# Altium project Instigator2012.PrjPcb
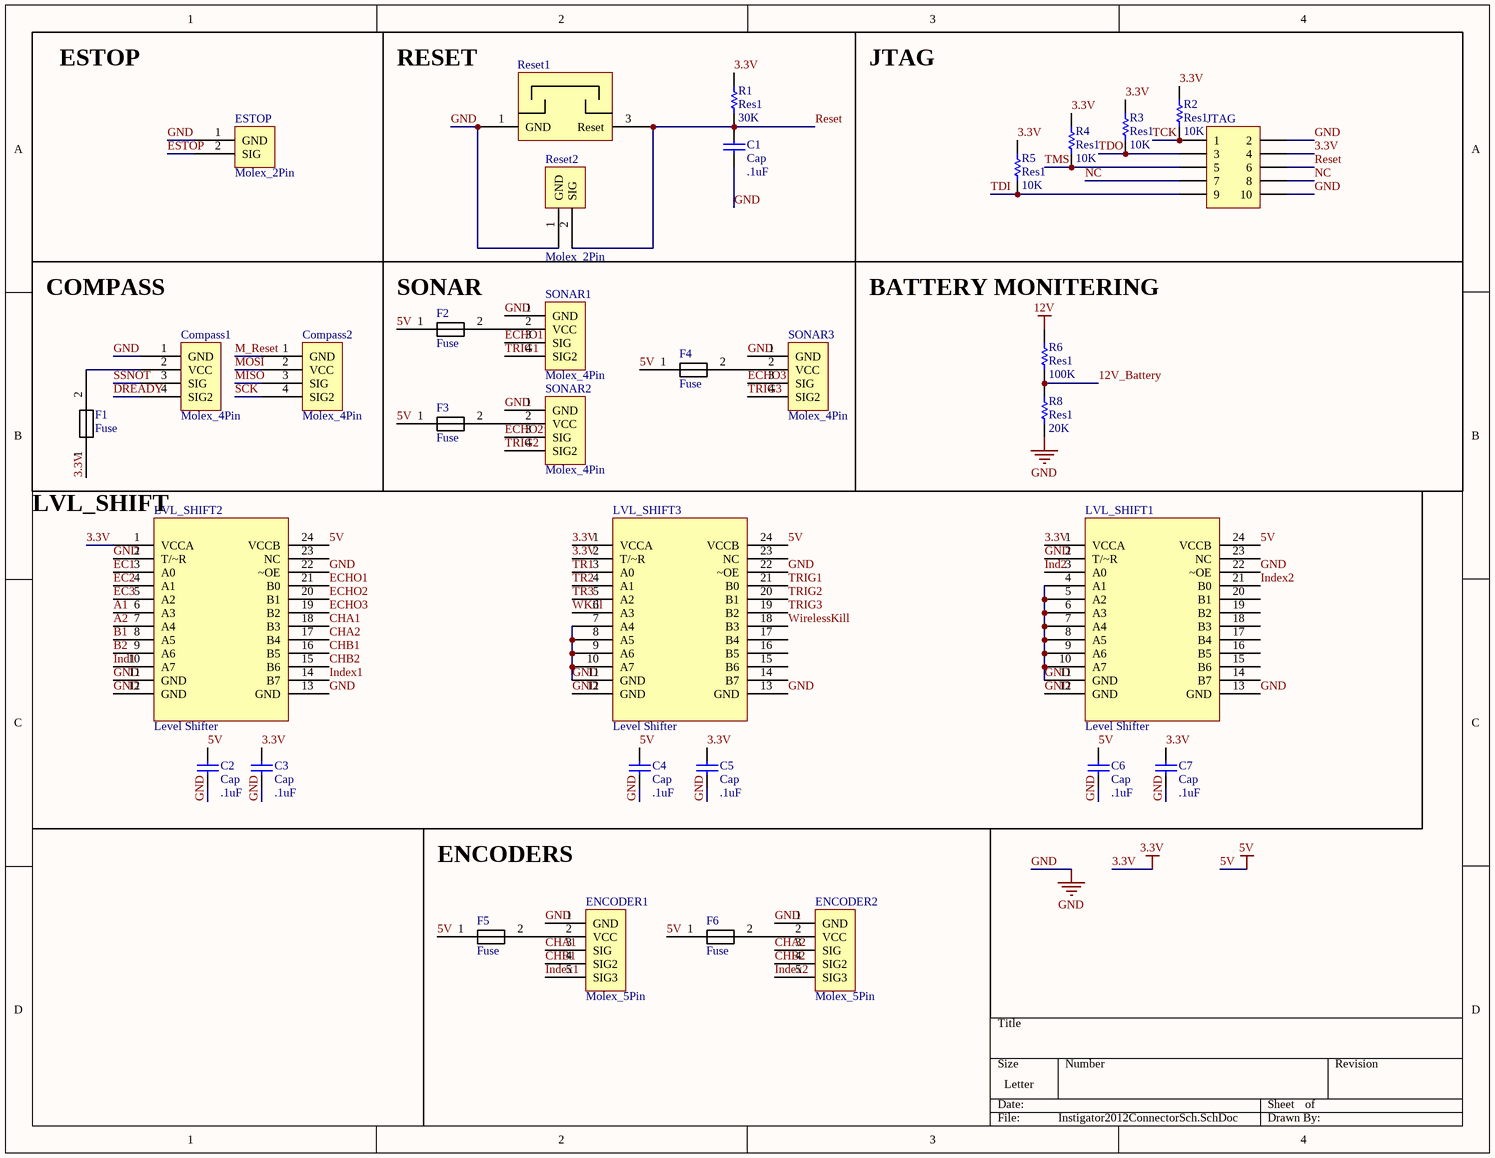
[diagram p0: Instigator2012ConnectorSch.SchDoc]
4 sheets, 101 parts. Net scope: global (net labels, ports and power ports of the same name join across sheets).
Board file: Instigator2012.PcbDoc
Sheets:
  Instigator2012ConnectorSch.SchDoc
  Instigator2012ControllerBoard.SchDoc
  Power_SolenoidKill.SchDoc
  USB_FTDI.SchDoc

## Sheet Instigator2012ConnectorSch.SchDoc
size Letter; DocumentNumber: 2; SheetNumber: 2; SheetTotal: 4

### Parts
C1  Cap  value .1uF  [1608[0603]]
C2  Cap  value .1uF  [1608[0603]]
C3  Cap  value .1uF  [1608[0603]]
C4  Cap  value .1uF  [1608[0603]]
C5  Cap  value .1uF  [1608[0603]]
C6  Cap  value .1uF  [1608[0603]]
C7  Cap  value .1uF  [1608[0603]]
Compass1  Molex_4Pin  [PCBComponent_1]
Compass2  Molex_4Pin  [PCBComponent_1]
ENCODER1  Molex_5Pin  [PCBComponent_1]
ENCODER2  Molex_5Pin  [PCBComponent_1]
ESTOP  Molex_2Pin  [PCBComponent_1]
F1  Fuse  [PCBComponent_1 - duplicate]
F2  Fuse  [PCBComponent_1 - duplicate]
F3  Fuse  [PCBComponent_1 - duplicate]
F4  Fuse  [PCBComponent_1 - duplicate]
F5  Fuse  [PCBComponent_1 - duplicate]
F6  Fuse  [PCBComponent_1 - duplicate]
JTAG  Header 5X2  [HDR2X5]  (value not drawn)
LVL_SHIFT1  Level Shifter  [TSOP65P640X110-24N]
LVL_SHIFT2  Level Shifter  [TSOP65P640X110-24N]
LVL_SHIFT3  Level Shifter  [TSOP65P640X110-24N]
R1  Res1  value 30K  [1608[0603]]
R2  Res1  value 10K  [1608[0603]]
R3  Res1  value 10K  [1608[0603]]
R4  Res1  value 10K  [1608[0603]]
R5  Res1  value 10K  [1608[0603]]
R6  Res1  value 100K  [1608[0603]]
R8  Res1  value 20K  [1608[0603]]
Reset1  l  [PCBComponent_1]  (value not drawn)
Reset2  Molex_2Pin  [PCBComponent_1]
SONAR1  Molex_4Pin  [PCBComponent_1]
SONAR2  Molex_4Pin  [PCBComponent_1]
SONAR3  Molex_4Pin  [PCBComponent_1]

### Blocks framed on the sheet
JTAG: JTAG R2-R5

### Nets
3.3V: C3.2 C5.2 C7.2 F1.1 JTAG.4 LVL_SHIFT1.1(VCCA) LVL_SHIFT2.1(VCCA) LVL_SHIFT3.1(VCCA) LVL_SHIFT3.2(T/~R) R1.2 R2.2 R3.2 R4.2 R5.2
5V: C2.2 C4.2 C6.2 F2.1 F3.1 F4.1 F5.1 F6.1 LVL_SHIFT1.24(VCCB) LVL_SHIFT2.24(VCCB) LVL_SHIFT3.24(VCCB)
12V: R6.2
GND: C1.1 C2.1 C3.1 C4.1 C5.1 C6.1 C7.1 Compass1.1(GND) ENCODER1.1(GND) ENCODER2.1(GND) ESTOP.1(GND) JTAG.2 JTAG.10 LVL_SHIFT1.2(T/~R) LVL_SHIFT1.4(A1) LVL_SHIFT1.5(A2) LVL_SHIFT1.6(A3) LVL_SHIFT1.7(A4) LVL_SHIFT1.8(A5) LVL_SHIFT1.9(A6) LVL_SHIFT1.10(A7) LVL_SHIFT1.11(GND) LVL_SHIFT1.12(GND) LVL_SHIFT1.13(GND) LVL_SHIFT1.22(~OE) LVL_SHIFT2.2(T/~R) LVL_SHIFT2.11(GND) LVL_SHIFT2.12(GND) LVL_SHIFT2.13(GND) LVL_SHIFT2.22(~OE) LVL_SHIFT3.7(A4) LVL_SHIFT3.8(A5) LVL_SHIFT3.9(A6) LVL_SHIFT3.10(A7) LVL_SHIFT3.11(GND) LVL_SHIFT3.12(GND) LVL_SHIFT3.13(GND) LVL_SHIFT3.22(~OE) R8.1 Reset1.1(GND) Reset2.1(GND) SONAR1.1(GND) SONAR2.1(GND) SONAR3.1(GND)
12V_Battery: R6.1 R8.2
A1: LVL_SHIFT2.6(A3)
A2: LVL_SHIFT2.7(A4)
B1: LVL_SHIFT2.8(A5)
B2: LVL_SHIFT2.9(A6)
CHA1: ENCODER1.3(SIG) LVL_SHIFT2.18(B3)
CHA2: ENCODER2.3(SIG) LVL_SHIFT2.17(B4)
CHB1: ENCODER1.4(SIG2) LVL_SHIFT2.16(B5)
CHB2: ENCODER2.4(SIG2) LVL_SHIFT2.15(B6)
DREADY: Compass1.4(SIG2)
EC1: LVL_SHIFT2.3(A0)
EC2: LVL_SHIFT2.4(A1)
EC3: LVL_SHIFT2.5(A2)
ECHO1: LVL_SHIFT2.21(B0) SONAR1.3(SIG)
ECHO2: LVL_SHIFT2.20(B1) SONAR2.3(SIG)
ECHO3: LVL_SHIFT2.19(B2) SONAR3.3(SIG)
ESTOP: ESTOP.2(SIG)
Ind1: LVL_SHIFT2.10(A7)
Ind2: LVL_SHIFT1.3(A0)
Index1: ENCODER1.5(SIG3) LVL_SHIFT2.14(B7)
Index2: ENCODER2.5(SIG3) LVL_SHIFT1.21(B0)
M_Reset: Compass2.1(GND)
MISO: Compass2.3(SIG)
MOSI: Compass2.2(VCC)
NC: JTAG.7 JTAG.8
Reset: C1.2 JTAG.6 R1.1 Reset1.3(Reset) Reset2.2(SIG)
SCK: Compass2.4(SIG2)
SSNOT: Compass1.3(SIG)
TCK: JTAG.1 R2.1
TDI: JTAG.9 R5.1
TDO: JTAG.3 R3.1
TMS: JTAG.5 R4.1
TR1: LVL_SHIFT3.3(A0)
TR2: LVL_SHIFT3.4(A1)
TR3: LVL_SHIFT3.5(A2)
TRIG1: LVL_SHIFT3.21(B0) SONAR1.4(SIG2)
TRIG2: LVL_SHIFT3.20(B1) SONAR2.4(SIG2)
TRIG3: LVL_SHIFT3.19(B2) SONAR3.4(SIG2)
WirelessKill: LVL_SHIFT3.18(B3)
WKill: LVL_SHIFT3.6(A3)
NetCompass1_2: Compass1.2(VCC) F1.2
NetENCODER1_2: ENCODER1.2(VCC) F5.2
NetENCODER2_2: ENCODER2.2(VCC) F6.2
NetF2_2: F2.2 SONAR1.2(VCC)
NetF3_2: F3.2 SONAR2.2(VCC)
NetF4_2: F4.2 SONAR3.2(VCC)

Not connected (* = marked no-connect by the designer): LVL_SHIFT1 14(B7) 15(B6) 16(B5) 17(B4) 18(B3) 19(B2) 20(B1) 23(NC); LVL_SHIFT2 23(NC); LVL_SHIFT3 14(B7) 15(B6) 16(B5) 17(B4) 23(NC)

### Notes on the sheet
- ESTOP
- RESET
- COMPASS
- (near F2) SONAR
- (near R6) BATTERY MONITERING
- (near LVL_SHIFT2) LVL_SHIFT
- ENCODERS

### Library data of the parts
C1-C7 = Cap: Capacitor; Published: 8-Jun-2000; LatestRevisionDate: 17-Jul-2002; LatestRevisionNote: Re-released for DXP Platform.; PackageReference: RAD-0.3; Publisher: Altium Limited; PackageDescription: Radial Cap, Thru-Hole; 2 Leads; 0.3 in Pin Spacing
JTAG = Header 5X2: Header, 5-Pin, Dual row; LatestRevisionDate: 17-Jul-2002; LatestRevisionNote: Re-released for DXP Platform.; Publisher: Altium Limited
R1-R6 R8 = Res1: Resistor; Published: 8-Jun-2000; LatestRevisionDate: 17-Jul-2002; LatestRevisionNote: Re-released for DXP Platform.; PackageReference: AXIAL-0.3; Publisher: Altium Limited; PackageDescription: Axial Device, Thru-Hole; 2 Leads; 0.3 in Pin Spacing
Reset1 = Component_1

## Sheet Instigator2012ControllerBoard.SchDoc
size Letter; DocumentNumber: 1; SheetNumber: 1; SheetTotal: 4
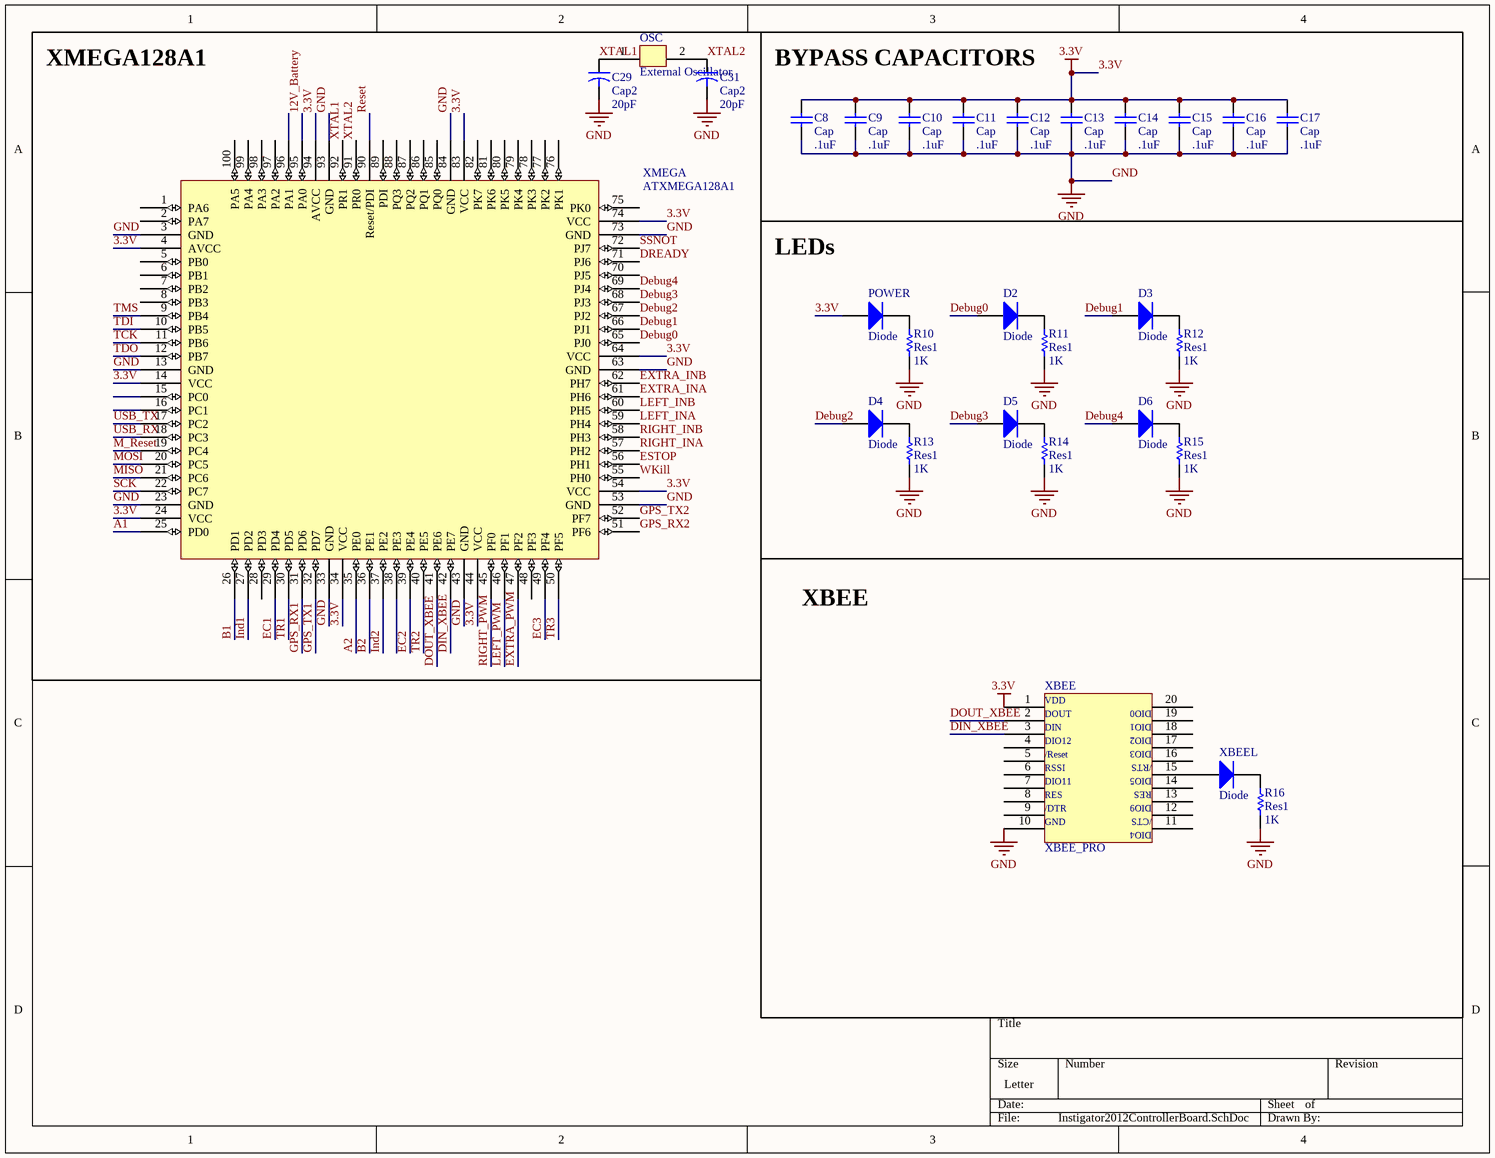
[diagram p1: Instigator2012ControllerBoard.SchDoc]

### Parts
C8  Cap  value .1uF  [1608[0603]]
C9  Cap  value .1uF  [1608[0603]]
C10  Cap  value .1uF  [1608[0603]]
C11  Cap  value .1uF  [1608[0603]]
C12  Cap  value .1uF  [1608[0603]]
C13  Cap  value .1uF  [1608[0603]]
C14  Cap  value .1uF  [1608[0603]]
C15  Cap  value .1uF  [1608[0603]]
C16  Cap  value .1uF  [1608[0603]]
C17  Cap  value .1uF  [1608[0603]]
C29  Cap2  value 20pF  [1608[0603]]
C31  Cap2  value 20pF  [1608[0603]]
D2  Diode  [1608[0603]]
D3  Diode  [1608[0603]]
D4  Diode  [1608[0603]]
D5  Diode  [1608[0603]]
D6  Diode  [1608[0603]]
OSC  External Oscillator  [PCBComponent_1 - duplicate3]
POWER  Diode  [1608[0603]]
R10  Res1  value 1K  [1608[0603]]
R11  Res1  value 1K  [1608[0603]]
R12  Res1  value 1K  [1608[0603]]
R13  Res1  value 1K  [1608[0603]]
R14  Res1  value 1K  [1608[0603]]
R15  Res1  value 1K  [1608[0603]]
R16  Res1  value 1K  [1608[0603]]
XBEE  XBEE_PRO  [PCBComponent_1]
XBEEL  Diode  [1608[0603]]
XMEGA  ATXMEGA128A1  [TSQFP50P1600X1600X120-100N]

### Blocks framed on the sheet
XMEGA128A1: C29 C31 OSC XMEGA

### Nets
3.3V: C8.2 C9.2 C10.2 C11.2 C12.2 C13.2 C14.2 C15.2 C16.2 C17.2 POWER.1(A) XBEE.1 XMEGA.4(AVCC) XMEGA.14(VCC) XMEGA.24(VCC) XMEGA.34(VCC) XMEGA.44(VCC) XMEGA.54(VCC) XMEGA.64(VCC) XMEGA.74(VCC) XMEGA.83(VCC) XMEGA.94(AVCC)
GND: C8.1 C9.1 C10.1 C11.1 C12.1 C13.1 C14.1 C15.1 C16.1 C17.1 C29.2 C31.2 R10.1 R11.1 R12.1 R13.1 R14.1 R15.1 R16.1 XBEE.10 XMEGA.3(GND) XMEGA.13(GND) XMEGA.23(GND) XMEGA.33(GND) XMEGA.43(GND) XMEGA.53(GND) XMEGA.63(GND) XMEGA.73(GND) XMEGA.84(GND) XMEGA.93(GND)
12V_Battery: XMEGA.95(PA0)
A1: XMEGA.25(PD0)
A2: XMEGA.35(PE0)
B1: XMEGA.26(PD1)
B2: XMEGA.36(PE1)
Debug0: D2.1(A) XMEGA.65(PJ0)
Debug1: D3.1(A) XMEGA.66(PJ1)
Debug2: D4.1(A) XMEGA.67(PJ2)
Debug3: D5.1(A) XMEGA.68(PJ3)
Debug4: D6.1(A) XMEGA.69(PJ4)
DIN_XBEE: XBEE.3 XMEGA.42(PE7)
DOUT_XBEE: XBEE.2 XMEGA.41(PE6)
DREADY: XMEGA.71(PJ6)
EC1: XMEGA.29(PD4)
EC2: XMEGA.39(PE4)
EC3: XMEGA.49(PF4)
ESTOP: XMEGA.56(PH1)
EXTRA_INA: XMEGA.61(PH6)
EXTRA_INB: XMEGA.62(PH7)
EXTRA_PWM: XMEGA.47(PF2)
GPS_RX1: XMEGA.31(PD6)
GPS_RX2: XMEGA.51(PF6)
GPS_TX1: XMEGA.32(PD7)
GPS_TX2: XMEGA.52(PF7)
Ind1: XMEGA.27(PD2)
Ind2: XMEGA.37(PE2)
LEFT_INA: XMEGA.59(PH4)
LEFT_INB: XMEGA.60(PH5)
LEFT_PWM: XMEGA.46(PF1)
M_Reset: XMEGA.19(PC4)
MISO: XMEGA.21(PC6)
MOSI: XMEGA.20(PC5)
Reset: XMEGA.90(Reset/PDI)
RIGHT_INA: XMEGA.57(PH2)
RIGHT_INB: XMEGA.58(PH3)
RIGHT_PWM: XMEGA.45(PF0)
SCK: XMEGA.22(PC7)
SSNOT: XMEGA.72(PJ7)
TCK: XMEGA.11(PB6)
TDI: XMEGA.10(PB5)
TDO: XMEGA.12(PB7)
TMS: XMEGA.9(PB4)
TR1: XMEGA.30(PD5)
TR2: XMEGA.40(PE5)
TR3: XMEGA.50(PF5)
USB_RX: XMEGA.18(PC3)
USB_TX: XMEGA.17(PC2)
WKill: XMEGA.55(PH0)
XTAL1: C29.1 OSC.1 XMEGA.92(PR1)
XTAL2: C31.1 OSC.2 XMEGA.91(PR0)
NetD2_2: D2.2(K) R11.2
NetD3_2: D3.2(K) R12.2
NetD4_2: D4.2(K) R13.2
NetD5_2: D5.2(K) R14.2
NetD6_2: D6.2(K) R15.2
NetPOWER_2: POWER.2(K) R10.2
NetR16_2: R16.2 XBEEL.2(K)
NetXBEE_15: XBEE.15 XBEEL.1(A)

Not connected (* = marked no-connect by the designer): XBEE 4 5 6 7 8 9 11 12 13 14 16 17 18 19 20; XMEGA 1(PA6) 2(PA7) 5(PB0) 6(PB1) 7(PB2) 8(PB3) 15(PC0) 16(PC1) 28(PD3) 38(PE3) 48(PF3) 70(PJ5) 75(PK0) 76(PK1) 77(PK2) 78(PK3) 79(PK4) 80(PK5) 81(PK6) 82(PK7) 85(PQ0) 86(PQ1) 87(PQ2) 88(PQ3) 89(PDI) 96(PA1) 97(PA2) 98(PA3) 99(PA4) 100(PA5)

### Notes on the sheet
- BYPASS CAPACITORS
- LEDs
- XBEE
- (in symbol XBEE) VDD; DIO0; DOUT; DIO1; DIN; DIO2; DIO12; DIO3; /Reset; /RTS; RSSI; DIO5; DIO11; RES; DIO9; /DTR; /CTS; GND; DIO4

### Library data of the parts
C8-C17 = Cap: Capacitor; Published: 8-Jun-2000; LatestRevisionDate: 17-Jul-2002; LatestRevisionNote: Re-released for DXP Platform.; PackageReference: RAD-0.3; Publisher: Altium Limited; PackageDescription: Radial Cap, Thru-Hole; 2 Leads; 0.3 in Pin Spacing
C29 C31 = Cap2: Capacitor; Published: 23-Sep-2002; PackageReference: CAPR5-4X5; Publisher: Altium Limited; PackageDescription: Capacitor; 2 Leads
D2-D6 POWER XBEEL = Diode: Default Diode; Published: 8-Jun-2000; LatestRevisionDate: 17-Jul-2002; LatestRevisionNote: Re-released for DXP Platform.; PackageVersion: Sep-1996; PackageReference: SMC; Publisher: Altium Limited; PackageDescription: DO-214-AB/SMC; 2 C-Bend Leads; Body 7.9 x 5.9 mm, inc. leads (LxW); Code_JEDEC: DO-214-AB
R10-R16 = Res1: Resistor; Published: 8-Jun-2000; LatestRevisionDate: 17-Jul-2002; LatestRevisionNote: Re-released for DXP Platform.; PackageReference: AXIAL-0.3; Publisher: Altium Limited; PackageDescription: Axial Device, Thru-Hole; 2 Leads; 0.3 in Pin Spacing
XBEE = XBEE

## Sheet Power_SolenoidKill.SchDoc
size Letter; DocumentNumber: 4; SheetNumber: 4; SheetTotal: 4
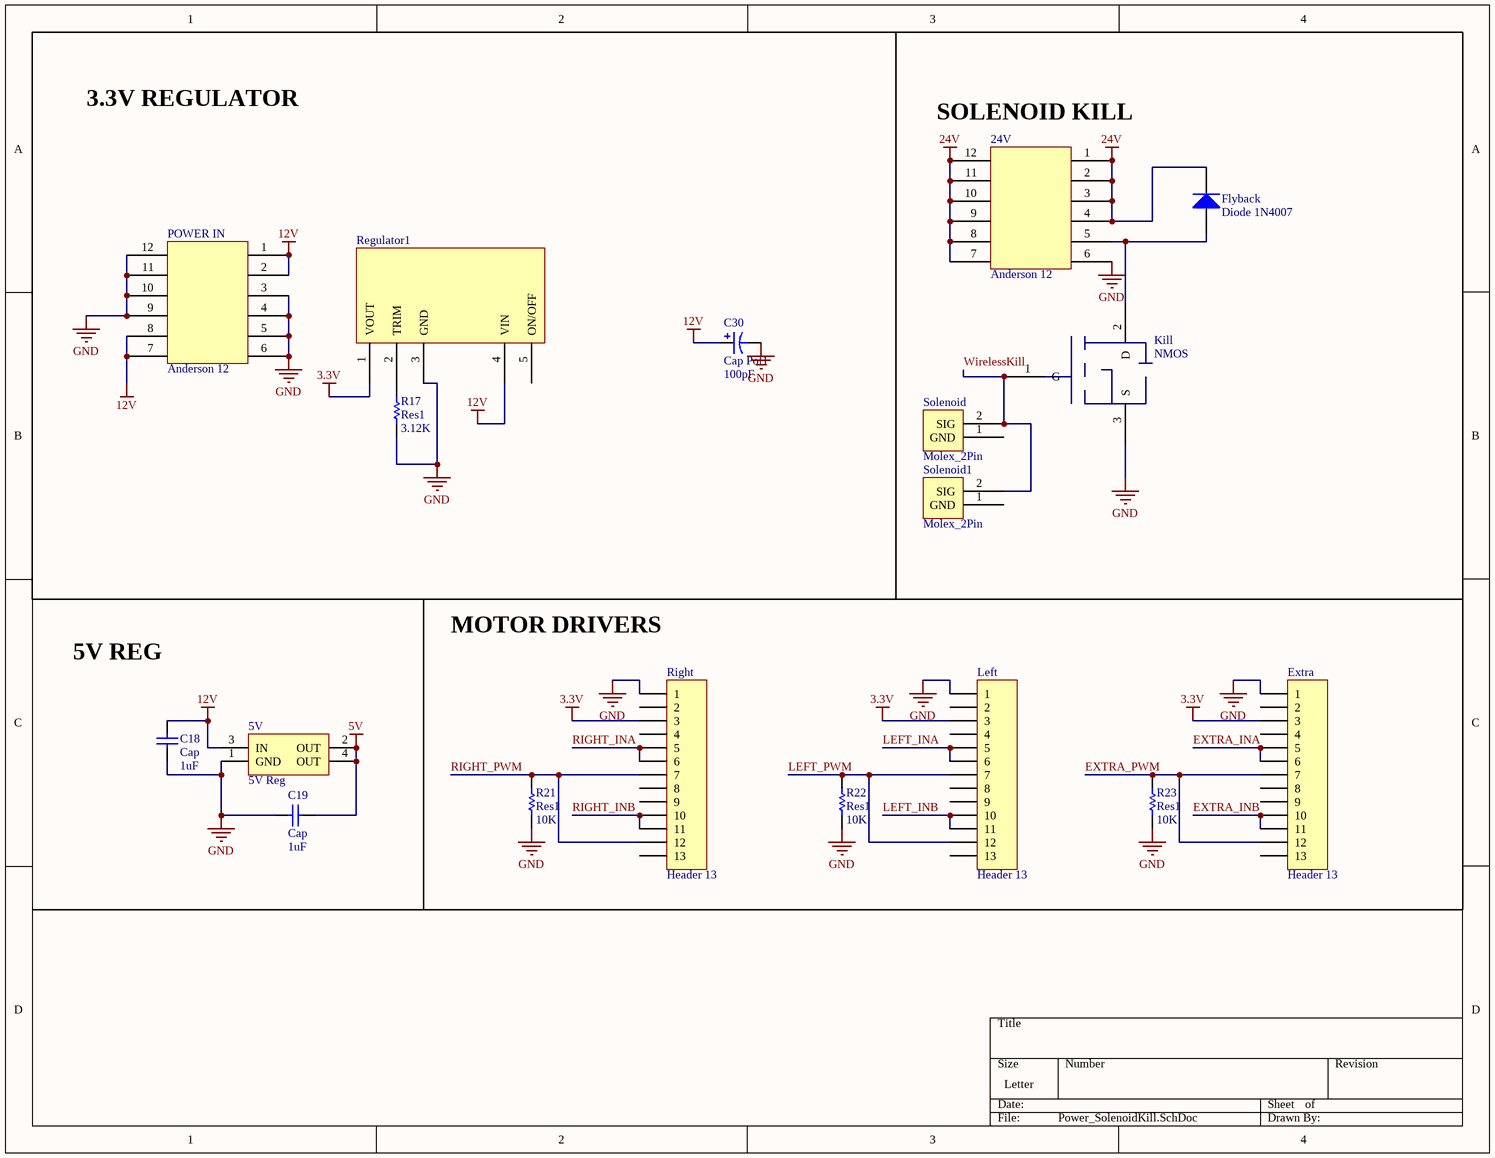
[diagram p2: Power_SolenoidKill.SchDoc]

### Parts
5V  5V Reg  [5V REG]
24V  Anderson 12  [PCBComponent_1 - duplicate2]
C18  Cap  value 1uF  [1608[0603]]
C19  Cap  value 1uF  [1608[0603]]
C30  Cap Pol1  value 100pF  [RB5-10.5]
Extra  Header 13  [HDR1X13]
Flyback  Diode 1N4007  [DO-41]
Kill  NMOS  [TO229P990X239-3N]
Left  Header 13  [HDR1X13]
POWER_IN  Anderson 12  [PCBComponent_1 - duplicate2]
R17  Res1  value 3.12K  [1608[0603]]
R21  Res1  value 10K  [1608[0603]]
R22  Res1  value 10K  [1608[0603]]
R23  Res1  value 10K  [1608[0603]]
Regulator1  Regulator  [PCBComponent_1]  (value not drawn)
Right  Header 13  [HDR1X13]
Solenoid  Molex_2Pin  [PCBComponent_1]
Solenoid1  Molex_2Pin  [PCBComponent_1]

### Blocks framed on the sheet
SOLENOID KILL: 24V Flyback Kill Solenoid Solenoid1

### Nets
3.3V: Extra.3 Left.3 Regulator1.1(VOUT) Right.3
5V: 5V.2(OUT) 5V.4(OUT) C19.1
12V: 5V.3(IN) C18.1 C30.1 POWER_IN.1 POWER_IN.2 POWER_IN.7 POWER_IN.8 Regulator1.4(VIN)
24V: 24V.1 24V.2 24V.3 24V.4 24V.7 24V.8 24V.9 24V.10 24V.11 24V.12 Flyback.2(K)
GND: 5V.1(GND) 24V.6 C18.2 C19.2 C30.2 Extra.1 Kill.3(S) Left.1 POWER_IN.3 POWER_IN.4 POWER_IN.5 POWER_IN.6 POWER_IN.9 POWER_IN.10 POWER_IN.11 POWER_IN.12 R17.1 R21.1 R22.1 R23.1 Regulator1.3(GND) Right.1
EXTRA_INA: Extra.5 Extra.6
EXTRA_INB: Extra.10 Extra.11
EXTRA_PWM: Extra.7 Extra.12 R23.2
LEFT_INA: Left.5 Left.6
LEFT_INB: Left.10 Left.11
LEFT_PWM: Left.7 Left.12 R22.2
RIGHT_INA: Right.5 Right.6
RIGHT_INB: Right.10 Right.11
RIGHT_PWM: R21.2 Right.7 Right.12
WirelessKill: Kill.1(G) Solenoid.2(SIG) Solenoid1.2(SIG)
Net24V_5: 24V.5 Flyback.1(A) Kill.2(D)
NetR17_2: R17.2 Regulator1.2(TRIM)

Not connected (* = marked no-connect by the designer): Extra 2 4 8 9 13; Left 2 4 8 9 13; Regulator1 5(ON/OFF); Right 2 4 8 9 13; Solenoid 1(GND); Solenoid1 1(GND)

### Notes on the sheet
- 3.3V REGULATOR
- MOTOR DRIVERS
- 5V REG

### Library data of the parts
5V = 5V Reg: 5V Linear Reg, 1.5A (Digi-Key: ADP3339AKCZ-5-R7CT-ND)
C18 C19 = Cap: Capacitor; Published: 8-Jun-2000; LatestRevisionDate: 17-Jul-2002; LatestRevisionNote: Re-released for DXP Platform.; PackageReference: RAD-0.3; Publisher: Altium Limited; PackageDescription: Radial Cap, Thru-Hole; 2 Leads; 0.3 in Pin Spacing
C30 = Cap Pol1: Polarized Capacitor (Radial); Published: 8-Jun-2000; LatestRevisionDate: 17-Jul-2002; LatestRevisionNote: Re-released for DXP Platform.; PackageReference: RB7.6-15; Publisher: Altium Limited; PackageDescription: Polarized Capacitor (Radial); 2 Leads
Extra Left Right = Header 13: Header, 13-Pin; LatestRevisionDate: 17-Jul-2002; LatestRevisionNote: Re-released for DXP Platform.; Publisher: Altium Limited
Flyback = Diode 1N4007: 1 Amp General Purpose Rectifier; Published: 8-Jun-2000; LatestRevisionDate: 17-Jul-2002; LatestRevisionNote: Re-released for DXP Platform.; DatasheetVersion: 1998; PackageVersion: Aug-1999; PackageReference: DO-41; Publisher: Altium Limited; PackageDescription: Diode, Axial; Body 5.2 x 2.7 mm (LxDia. max), Lead Dia. 0.86 mm (max); Code_JEDEC: DO-204-AL; ComponentLink1Description: Manufacturer Link; ComponentLink1URL: http://www.fairchildsemi.com/; ComponentLink2Description: Datasheet; ComponentLink2URL: http://www.fairchildsemi.com/ds/1N%2F1N4001.pdf
R17 R21-R23 = Res1: Resistor; Published: 8-Jun-2000; LatestRevisionDate: 17-Jul-2002; LatestRevisionNote: Re-released for DXP Platform.; PackageReference: AXIAL-0.3; Publisher: Altium Limited; PackageDescription: Axial Device, Thru-Hole; 2 Leads; 0.3 in Pin Spacing

## Sheet USB_FTDI.SchDoc
size Letter
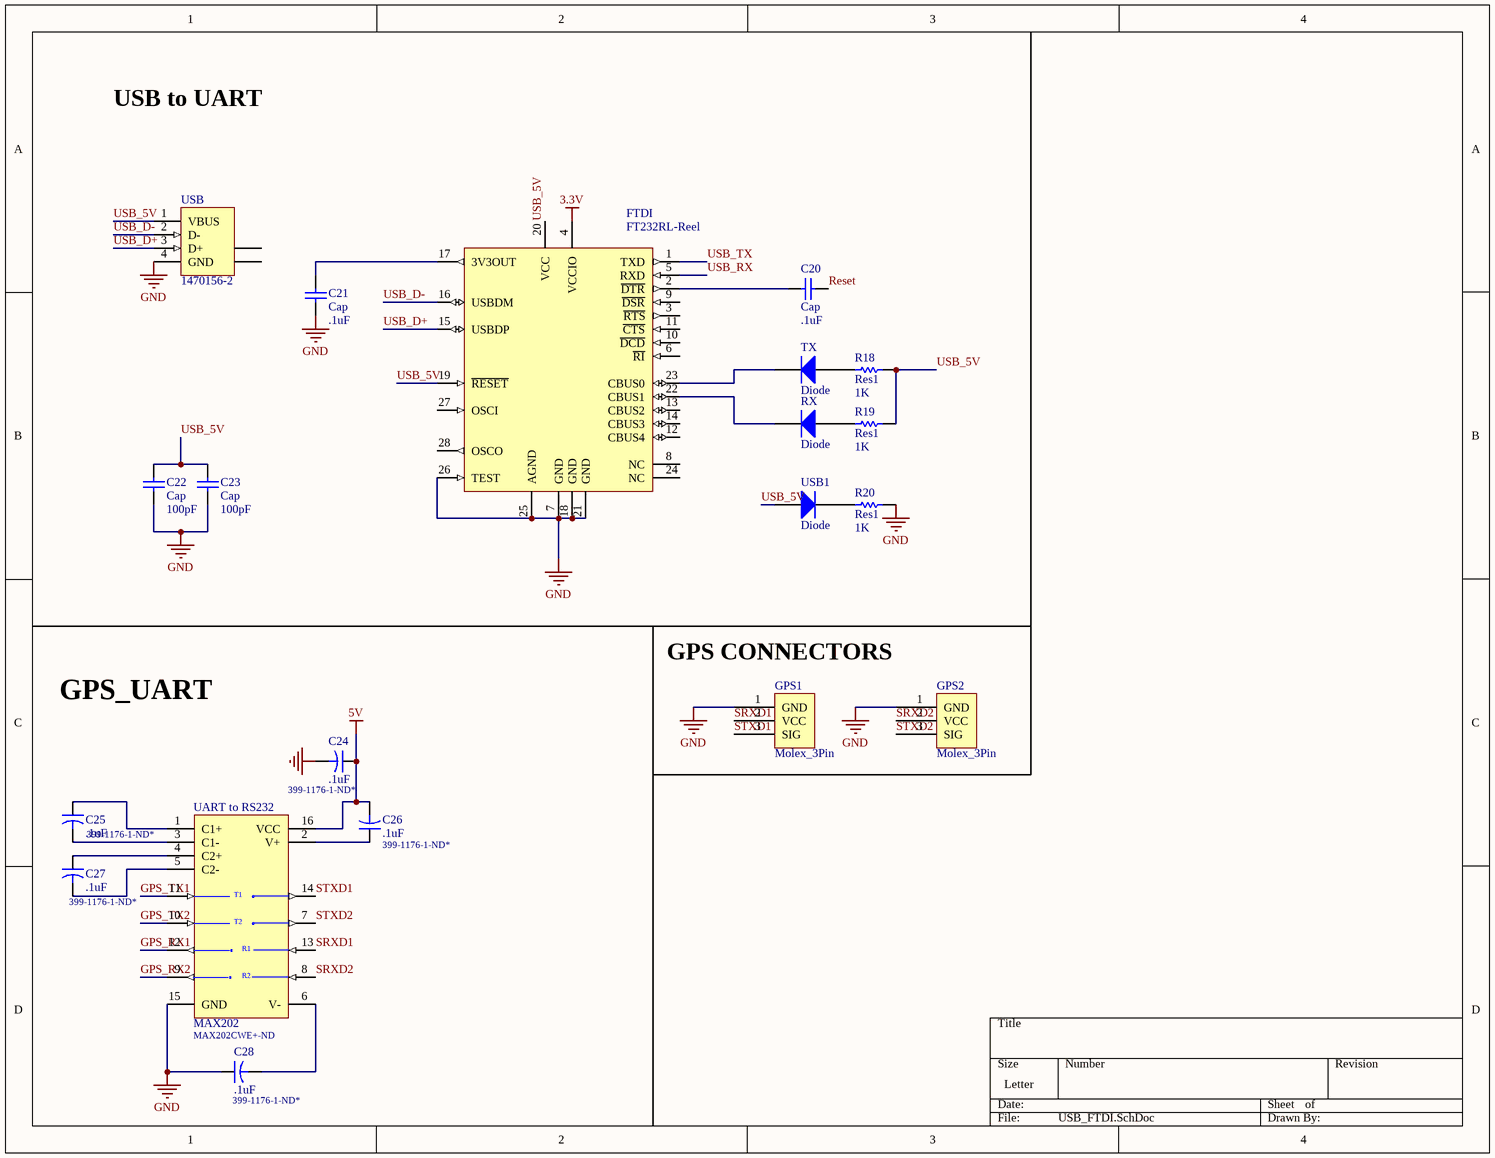
[diagram p3: USB_FTDI.SchDoc]

### Parts
C20  Cap  value .1uF  [1608[0603]]
C21  Cap  value .1uF  [1608[0603]]
C22  Cap  value 100pF  [1608[0603]]
C23  Cap  value 100pF  [1608[0603]]
C24  .1uF  [1608[0603]]
C25  .1uF  [1608[0603]]
C26  .1uF  [1608[0603]]
C27  .1uF  [1608[0603]]
C28  .1uF  [1608[0603]]
FTDI  FT232RL-Reel  [SSOP-28_N]
GPS1  Molex_3Pin  [PCBComponent_1]
GPS2  Molex_3Pin  [PCBComponent_1]
R18  Res1  value 1K  [1608[0603]]
R19  Res1  value 1K  [1608[0603]]
R20  Res1  value 1K  [1608[0603]]
RX  Diode  [1608[0603]]
TX  Diode  [1608[0603]]
UART_to_RS232  MAX202  [WSO16_N]
USB  1470156-2  [1470156]
USB1  Diode  [1608[0603]]

### Nets
3.3V: FTDI.4(VCCIO)
5V: C24.1 C26.2 UART_to_RS232.16(VCC)
GND: C21.1 C22.1 C23.1 C24.2 C28.1 FTDI.7(GND) FTDI.18(GND) FTDI.21(GND) FTDI.25(AGND) FTDI.26(TEST) GPS1.1(GND) GPS2.1(GND) R20.2 UART_to_RS232.15(GND) USB.4(GND)
GPS_RX1: UART_to_RS232.12(R1OUT)
GPS_RX2: UART_to_RS232.9(R2OUT)
GPS_TX1: UART_to_RS232.11(T1IN)
GPS_TX2: UART_to_RS232.10(T2IN)
Reset: C20.1
SRXD1: GPS1.2(VCC) UART_to_RS232.13(R1IN)
SRXD2: GPS2.2(VCC) UART_to_RS232.8(R2IN)
STXD1: GPS1.3(SIG) UART_to_RS232.14(T1OUT)
STXD2: GPS2.3(SIG) UART_to_RS232.7(T2OUT)
USB_5V: C22.2 C23.2 FTDI.19(~{RESET}) FTDI.20(VCC) R18.2 R19.2 USB.1(VBUS) USB1.1(A)
USB_D+: FTDI.15(USBDP) USB.3(D+)
USB_D-: FTDI.16(USBDM) USB.2(D-)
USB_RX: FTDI.5(RXD)
USB_TX: FTDI.1(TXD)
NetC20_2: C20.2 FTDI.2(~{DTR})
NetC21_2: C21.2 FTDI.17(3V3OUT)
NetC25_1: C25.1 UART_to_RS232.1(C1+)
NetC25_2: C25.2 UART_to_RS232.3(C1-)
NetC26_1: C26.1 UART_to_RS232.2(V+)
NetC27_1: C27.1 UART_to_RS232.4(C2+)
NetC27_2: C27.2 UART_to_RS232.5(C2-)
NetC28_2: C28.2 UART_to_RS232.6(V-)
NetFTDI_22: FTDI.22(CBUS1) RX.2(K)
NetFTDI_23: FTDI.23(CBUS0) TX.2(K)
NetR18_1: R18.1 TX.1(A)
NetR19_1: R19.1 RX.1(A)
NetR20_1: R20.1 USB1.2(K)

Not connected (* = marked no-connect by the designer): FTDI 3(~{RTS}) 6(~{RI}) 8(NC) 9(~{DSR}) 10(~{DCD}) 11(~{CTS}) 12(CBUS4) 13(CBUS2) 14(CBUS3) 24(NC) 27(OSCI) 28(OSCO); USB 5(SHLD) 6(SHLD)

### Notes on the sheet
- USB to UART
- GPS_UART
- (near GPS1) GPS CONNECTORS
- (near C25) 399-1176-1-ND*
- 399-1176-1-ND*
- (near C27) 399-1176-1-ND*
- (near C26) 399-1176-1-ND*
- MAX202CWE+-ND
- (near C28) 399-1176-1-ND*
- (in symbol MAX202CWE) T1; T2; R1; R2

### Library data of the parts
C20-C23 = Cap: Capacitor; Published: 8-Jun-2000; LatestRevisionDate: 17-Jul-2002; LatestRevisionNote: Re-released for DXP Platform.; PackageReference: RAD-0.3; Publisher: Altium Limited; PackageDescription: Radial Cap, Thru-Hole; 2 Leads; 0.3 in Pin Spacing
C24-C28 = 0805 Cap
FTDI = FT232RL-Reel: USB UART Asynchronous Serial Data Transfer Chip, SSOP-28, Tape and Reel; Published: 19-Aug-2010; DatasheetVersion: ver 2.07, Jul-2010; PackageVersion: 2010; PackageReference: SSOP-28; Publisher: Altium Limited; PackageDescription: 28-Pin Small Outline Package 0.65 mm Pitch; ComponentLink1Description: Manufacturer Link; ComponentLink1URL: http://www.ftdichip.com/Products/ICs/FT232R.htm; ComponentLink2Description: Datasheet; ComponentLink2URL: http://www.ftdichip.com/Support/Documents/DataSheets/ICs/DS_FT232R.pdf
R18-R20 = Res1: Resistor; Published: 8-Jun-2000; LatestRevisionDate: 17-Jul-2002; LatestRevisionNote: Re-released for DXP Platform.; PackageReference: AXIAL-0.3; Publisher: Altium Limited; PackageDescription: Axial Device, Thru-Hole; 2 Leads; 0.3 in Pin Spacing
RX TX USB1 = Diode: Default Diode; Published: 8-Jun-2000; LatestRevisionDate: 17-Jul-2002; LatestRevisionNote: Re-released for DXP Platform.; PackageVersion: Sep-1996; PackageReference: SMC; Publisher: Altium Limited; PackageDescription: DO-214-AB/SMC; 2 C-Bend Leads; Body 7.9 x 5.9 mm, inc. leads (LxW); Code_JEDEC: DO-214-AB
UART_to_RS232 = MAX202CWE: +5V RS-232 Transceiver with 0.1µF External Capacitor (Digi-Key#: MAX202CWE+-ND); Published: 16-Jan-2001; LatestRevisionDate: 13-Apr-2006; LatestRevisionNote: IPC-7351 Footprint Added.; DatasheetVersion: Dec-1996; PackageReference: WSO16; Publisher: Altium Limited; PackageDescription: 16-Pin Small Outline Integrated Circuit 1.27 mm Pitch; Code_JEDEC: MS-013-AA; Code_IPC: SOIC127P1030-16; ComponentLink1Description: Manufacturer Link; ComponentLink1URL: http://www.maxim-ic.com/; ComponentLink2Description: Datasheet; ComponentLink2URL: http://pdfserv.maxim-ic.com/en/ds/MAX200-MAX213.pdf
USB = 1470156-2: USB 1.1, Right Angle, Thru-Hole, B Type, Receptacle, 4 Position, Black; ContactMaterial: Phosphor Bronze; ContactPlating: Gold over Nickel; TerminationLength: 3.00mm [0.118in.]; PCB_Layout: Complies with manufacturer's recommendation.; DrillSize: Corresponds to nominal value.; PanelGround: Without; Published: 15-Jul-2004; DatasheetDocument: 02-Jun-2001; PackageDocument: 02-Jun-2001; PackageReference: 1470156; Publisher: Altium Limited; HousingMaterial: Glass-Filled Thermoplastic; ComponentLink1Description: Manufacturer Link; ComponentLink1URL: http://www.tycoelectronics.com/; ComponentLink2Description: Packaging Specification; ComponentLink2URL: http://ecommas.tycoelectronics.com/commerce/DocumentDelivery/DDEController?Action=showdoc&DocId=Customer+Drawing%7F1470156%7FO%7Ftif%7FEnglish%7FC_1470156_O.tif

## Nets that join several sheets
3.3V: Instigator2012ConnectorSch (14 pins), Instigator2012ControllerBoard (22 pins), Power_SolenoidKill (Extra.3 Left.3 Regulator1.1 Right.3), USB_FTDI (FTDI.4)
5V: Instigator2012ConnectorSch (11 pins), Power_SolenoidKill (5V.2 5V.4 C19.1), USB_FTDI (C24.1 C26.2 UART_to_RS232.16)
12V: Instigator2012ConnectorSch (R6.2), Power_SolenoidKill (8 pins)
GND: Instigator2012ConnectorSch (44 pins), Instigator2012ControllerBoard (30 pins), Power_SolenoidKill (22 pins), USB_FTDI (15 pins)
12V_Battery: Instigator2012ConnectorSch (R6.1 R8.2), Instigator2012ControllerBoard (XMEGA.95)
A1: Instigator2012ConnectorSch (LVL_SHIFT2.6), Instigator2012ControllerBoard (XMEGA.25)
A2: Instigator2012ConnectorSch (LVL_SHIFT2.7), Instigator2012ControllerBoard (XMEGA.35)
B1: Instigator2012ConnectorSch (LVL_SHIFT2.8), Instigator2012ControllerBoard (XMEGA.26)
B2: Instigator2012ConnectorSch (LVL_SHIFT2.9), Instigator2012ControllerBoard (XMEGA.36)
DREADY: Instigator2012ConnectorSch (Compass1.4), Instigator2012ControllerBoard (XMEGA.71)
EC1: Instigator2012ConnectorSch (LVL_SHIFT2.3), Instigator2012ControllerBoard (XMEGA.29)
EC2: Instigator2012ConnectorSch (LVL_SHIFT2.4), Instigator2012ControllerBoard (XMEGA.39)
EC3: Instigator2012ConnectorSch (LVL_SHIFT2.5), Instigator2012ControllerBoard (XMEGA.49)
ESTOP: Instigator2012ConnectorSch (ESTOP.2), Instigator2012ControllerBoard (XMEGA.56)
EXTRA_INA: Instigator2012ControllerBoard (XMEGA.61), Power_SolenoidKill (Extra.5 Extra.6)
EXTRA_INB: Instigator2012ControllerBoard (XMEGA.62), Power_SolenoidKill (Extra.10 Extra.11)
EXTRA_PWM: Instigator2012ControllerBoard (XMEGA.47), Power_SolenoidKill (Extra.7 Extra.12 R23.2)
GPS_RX1: Instigator2012ControllerBoard (XMEGA.31), USB_FTDI (UART_to_RS232.12)
GPS_RX2: Instigator2012ControllerBoard (XMEGA.51), USB_FTDI (UART_to_RS232.9)
GPS_TX1: Instigator2012ControllerBoard (XMEGA.32), USB_FTDI (UART_to_RS232.11)
GPS_TX2: Instigator2012ControllerBoard (XMEGA.52), USB_FTDI (UART_to_RS232.10)
Ind1: Instigator2012ConnectorSch (LVL_SHIFT2.10), Instigator2012ControllerBoard (XMEGA.27)
Ind2: Instigator2012ConnectorSch (LVL_SHIFT1.3), Instigator2012ControllerBoard (XMEGA.37)
LEFT_INA: Instigator2012ControllerBoard (XMEGA.59), Power_SolenoidKill (Left.5 Left.6)
LEFT_INB: Instigator2012ControllerBoard (XMEGA.60), Power_SolenoidKill (Left.10 Left.11)
LEFT_PWM: Instigator2012ControllerBoard (XMEGA.46), Power_SolenoidKill (Left.7 Left.12 R22.2)
M_Reset: Instigator2012ConnectorSch (Compass2.1), Instigator2012ControllerBoard (XMEGA.19)
MISO: Instigator2012ConnectorSch (Compass2.3), Instigator2012ControllerBoard (XMEGA.21)
MOSI: Instigator2012ConnectorSch (Compass2.2), Instigator2012ControllerBoard (XMEGA.20)
Reset: Instigator2012ConnectorSch (5 pins), Instigator2012ControllerBoard (XMEGA.90), USB_FTDI (C20.1)
RIGHT_INA: Instigator2012ControllerBoard (XMEGA.57), Power_SolenoidKill (Right.5 Right.6)
RIGHT_INB: Instigator2012ControllerBoard (XMEGA.58), Power_SolenoidKill (Right.10 Right.11)
RIGHT_PWM: Instigator2012ControllerBoard (XMEGA.45), Power_SolenoidKill (R21.2 Right.7 Right.12)
SCK: Instigator2012ConnectorSch (Compass2.4), Instigator2012ControllerBoard (XMEGA.22)
SSNOT: Instigator2012ConnectorSch (Compass1.3), Instigator2012ControllerBoard (XMEGA.72)
TCK: Instigator2012ConnectorSch (JTAG.1 R2.1), Instigator2012ControllerBoard (XMEGA.11)
TDI: Instigator2012ConnectorSch (JTAG.9 R5.1), Instigator2012ControllerBoard (XMEGA.10)
TDO: Instigator2012ConnectorSch (JTAG.3 R3.1), Instigator2012ControllerBoard (XMEGA.12)
TMS: Instigator2012ConnectorSch (JTAG.5 R4.1), Instigator2012ControllerBoard (XMEGA.9)
TR1: Instigator2012ConnectorSch (LVL_SHIFT3.3), Instigator2012ControllerBoard (XMEGA.30)
TR2: Instigator2012ConnectorSch (LVL_SHIFT3.4), Instigator2012ControllerBoard (XMEGA.40)
TR3: Instigator2012ConnectorSch (LVL_SHIFT3.5), Instigator2012ControllerBoard (XMEGA.50)
USB_RX: Instigator2012ControllerBoard (XMEGA.18), USB_FTDI (FTDI.5)
USB_TX: Instigator2012ControllerBoard (XMEGA.17), USB_FTDI (FTDI.1)
WirelessKill: Instigator2012ConnectorSch (LVL_SHIFT3.18), Power_SolenoidKill (Kill.1 Solenoid.2 Solenoid1.2)
WKill: Instigator2012ConnectorSch (LVL_SHIFT3.6), Instigator2012ControllerBoard (XMEGA.55)